# EAGLE design paste_injector (EAGLE 6.5.0)
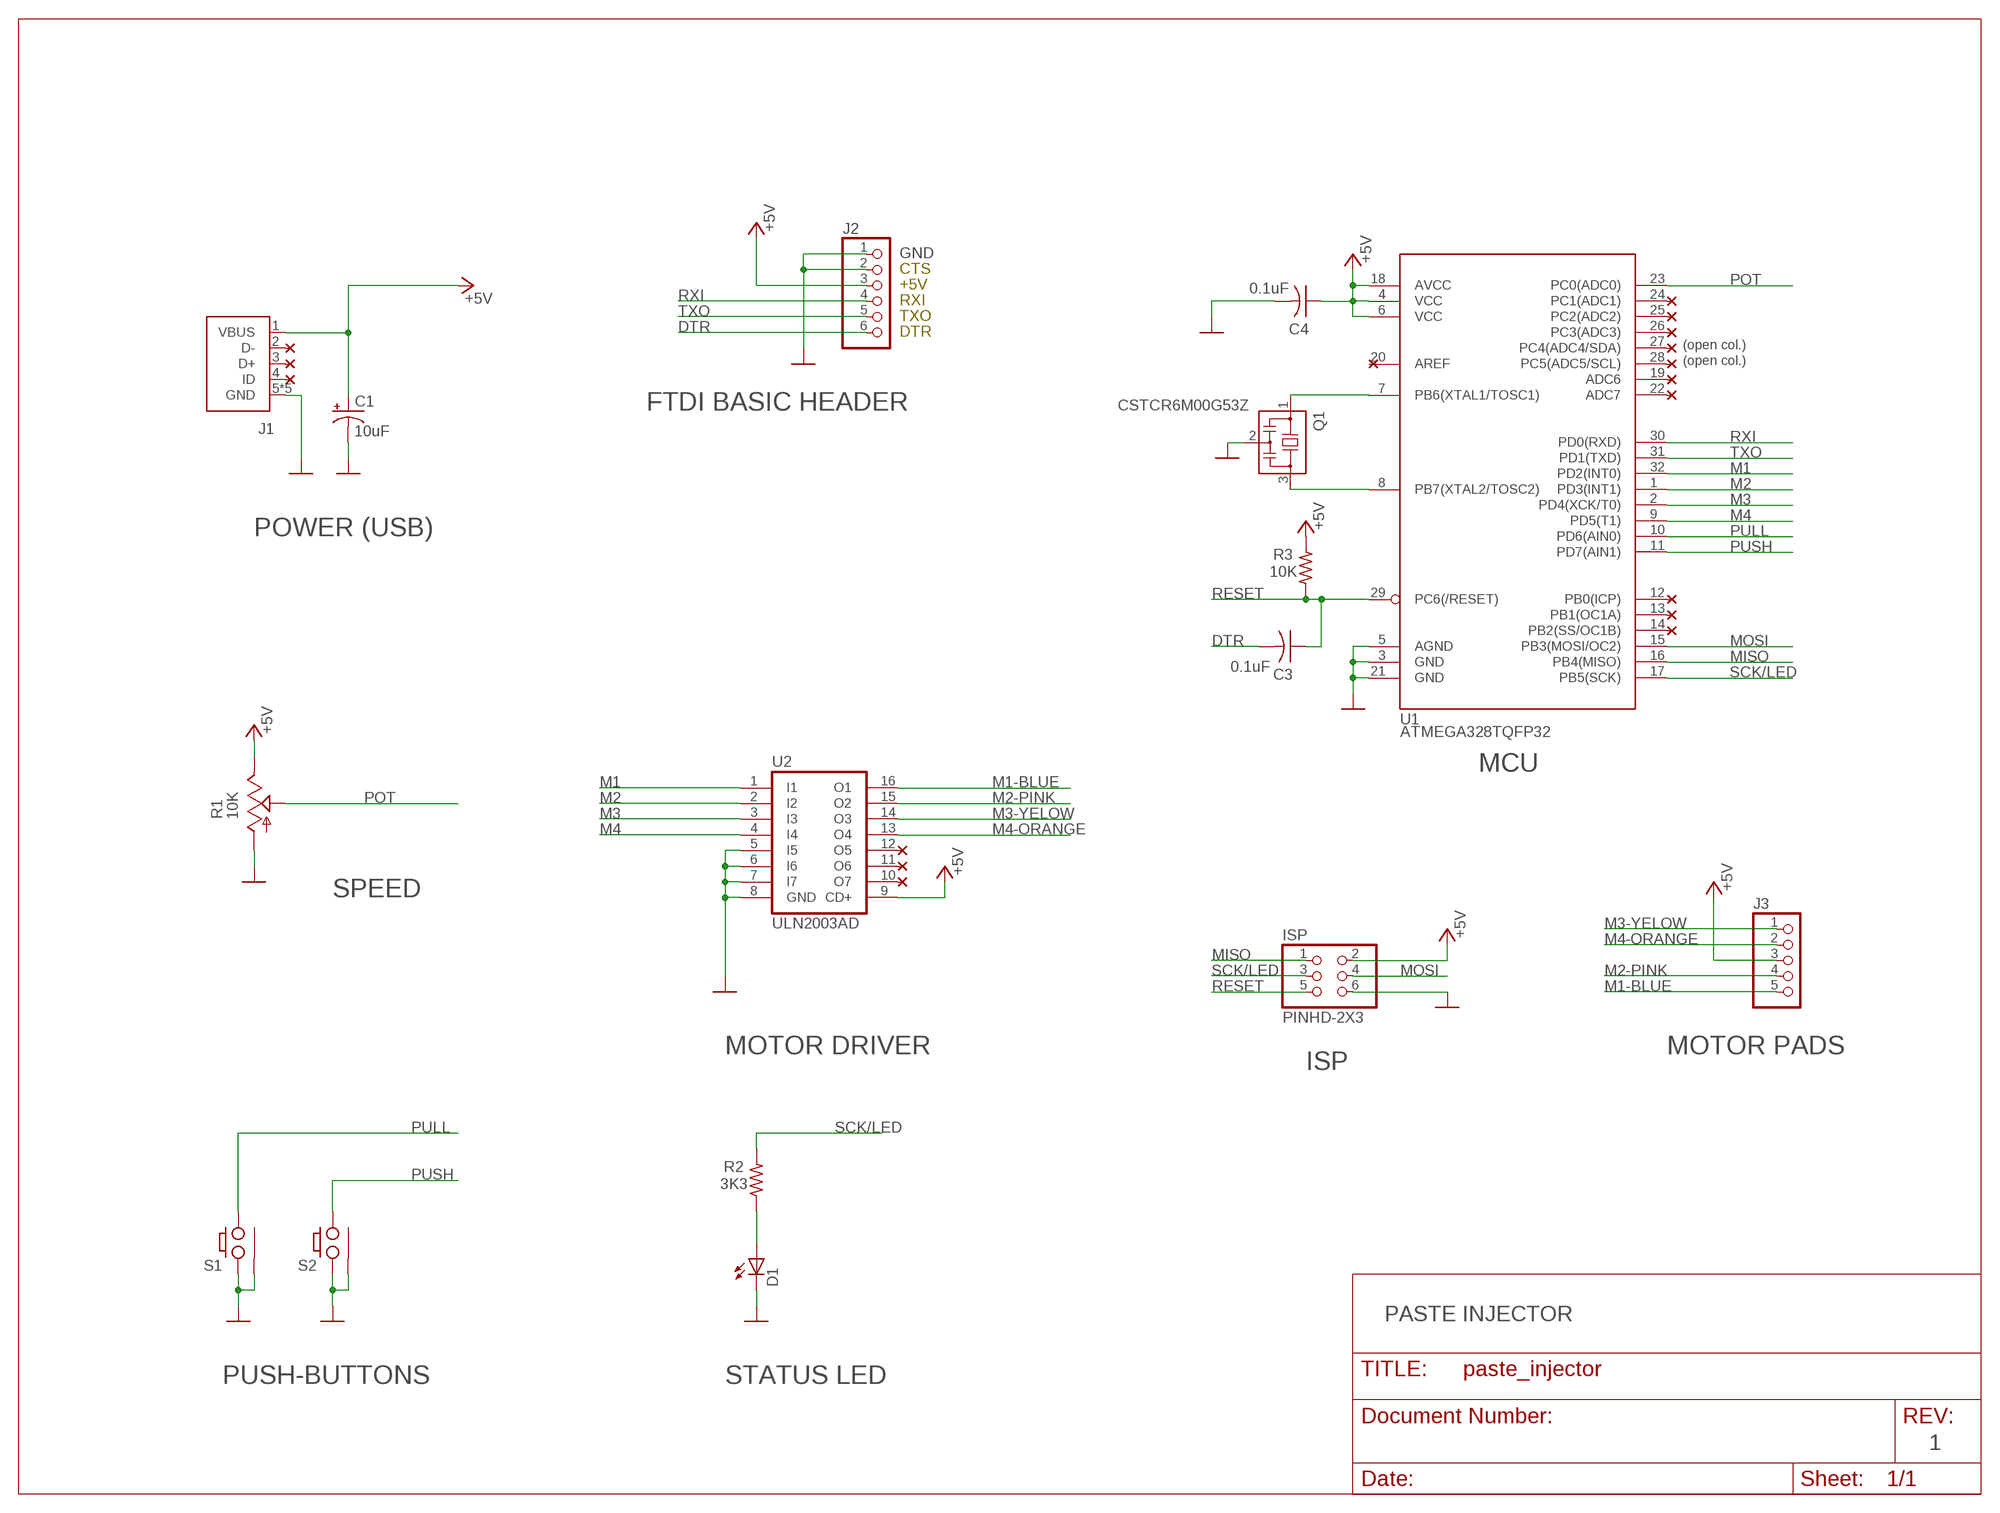
[diagram p0: schematic, sheet 1]

## Parts
C1  10uF  CPOL-USA/3216-18R  [A/3216-18R]
C3  0.1uF  CAP-C0603  [C0603]
C4  0.1uF  CAP-C0603  [C0603]
D1  LED  [LED0603]
ISP  PINHD-2X3  [2X03]
J1  USB  [USB-MICRO-ZX62RD-AB-5P8]
J2  PINHD-1X6  [1X06]
J3  PINHD-1X5  [1X05]
Q1  CSTCR6M00G53Z  [CSTCR6M]
R1  10K  TRIMPOTCA9V  [TRIMPOT]
R2  3K3  RES-R0603  [R0603]
R3  10K  RES-R0603  [R0603]
S1  PUSH_BUTTON  [PUSH_BUTTON]
S2  PUSH_BUTTON  [PUSH_BUTTON]
U1  ATMEGA328TQFP32  [TQFP32-08]
U2  ULN2003AD  [SO16]

## Nets
+5V [power]: C1.+ C4.1 ISP.2 J1.1(VBUS) J2.3 J3.3 R1.CW R3.2 U1.4(VCC) U1.6(VCC) U1.18(AVCC) U2.9(CD+)
DTR: C3.2 J2.6
GND [power]: C1.- C4.2 D1.C ISP.6 J1.5(GND) J1.A(GND) J1.B(GND) J1.C(GND) J1.D(GND) J2.1 J2.2 Q1.2 R1.CCW S1.A1 S1.GND S2.A1 S2.GND U1.3(GND) U1.5(AGND) U1.21(GND) U2.5(I5) U2.6(I6) U2.7(I7) U2.8(GND)
M1: U1.32(PD2(INT0)) U2.1(I1)
M1-BLUE: J3.5 U2.16(O1)
M2: U1.1(PD3(INT1)) U2.2(I2)
M2-PINK: J3.4 U2.15(O2)
M3: U1.2(PD4(XCK/T0)) U2.3(I3)
M3-YELOW: J3.1 U2.14(O3)
M4: U1.9(PD5(T1)) U2.4(I4)
M4-ORANGE: J3.2 U2.13(O4)
MISO: ISP.1 U1.16(PB4(MISO))
MOSI: ISP.4 U1.15(PB3(MOSI/OC2))
N$1: D1.A R2.1
N$2: Q1.1 U1.7(PB6(XTAL1/TOSC1))
N$7: Q1.3 U1.8(PB7(XTAL2/TOSC2))
POT: R1.C U1.23(PC0(ADC0))
PULL: S1.B1 U1.10(PD6(AIN0))
PUSH: S2.B1 U1.11(PD7(AIN1))
RESET: C3.1 ISP.5 R3.1 U1.29(PC6(/RESET))
RXI: J2.4 U1.30(PD0(RXD))
SCK/LED: ISP.3 R2.2 U1.17(PB5(SCK))
TXO: J2.5 U1.31(PD1(TXD))
Unconnected: J1.2(D-) J1.3(D+) J1.4(ID) U1.12(PB0(ICP)) U1.13(PB1(OC1A)) U1.14(PB2(SS/OC1B)) U1.19(ADC6) U1.20(AREF) U1.22(ADC7) U1.24(PC1(ADC1)) U1.25(PC2(ADC2)) U1.26(PC3(ADC3)) U1.27(PC4(ADC4/SDA)) U1.28(PC5(ADC5/SCL)) U2.10(O7) U2.11(O6) U2.12(O5)

## Notes on the sheet
- GND
- CTS
- +5V
- RXI
- TXO
- DTR
- (open col.)
- (open col.)
- FTDI BASIC HEADER
- POWER (USB)
- MCU
- SPEED
- MOTOR DRIVER | MOTOR PADS
- ISP
- PASTE INJECTOR
- PUSH-BUTTONS | STATUS LED
- 1

## Library data of the parts
C1 = paste_injector:CPOL-US
C3 C4 = paste_injector:CAP-: CAPACITOR, American symbol
D1 = paste_injector:LED
ISP = paste_injector:PINHD-2X3
J1 = paste_injector:USB
J2 = paste_injector:PINHD-1X6: PIN HEADER
J3 = paste_injector:PINHD-1X5: PIN HEADER
Q1 = paste_injector:CSTCR: Resonator Source: murata.co.jp; MPN: CSTCR6M00G53-R0; OC_FARNELL: 1170434; OC_NEWARK: 25M8759
R1 = paste_injector:TRIMPOT: POTENTIOMETER
R2 R3 = paste_injector:RES-: RESISTOR, American symbol
S1 S2 = paste_injector:PUSH_BUTTON
U1 = paste_injector:ATMEGA328
U2 = paste_injector:ULN2003A: DRIVER ARRAY

## Net classes
1 power: width 0.305 mm

## Board
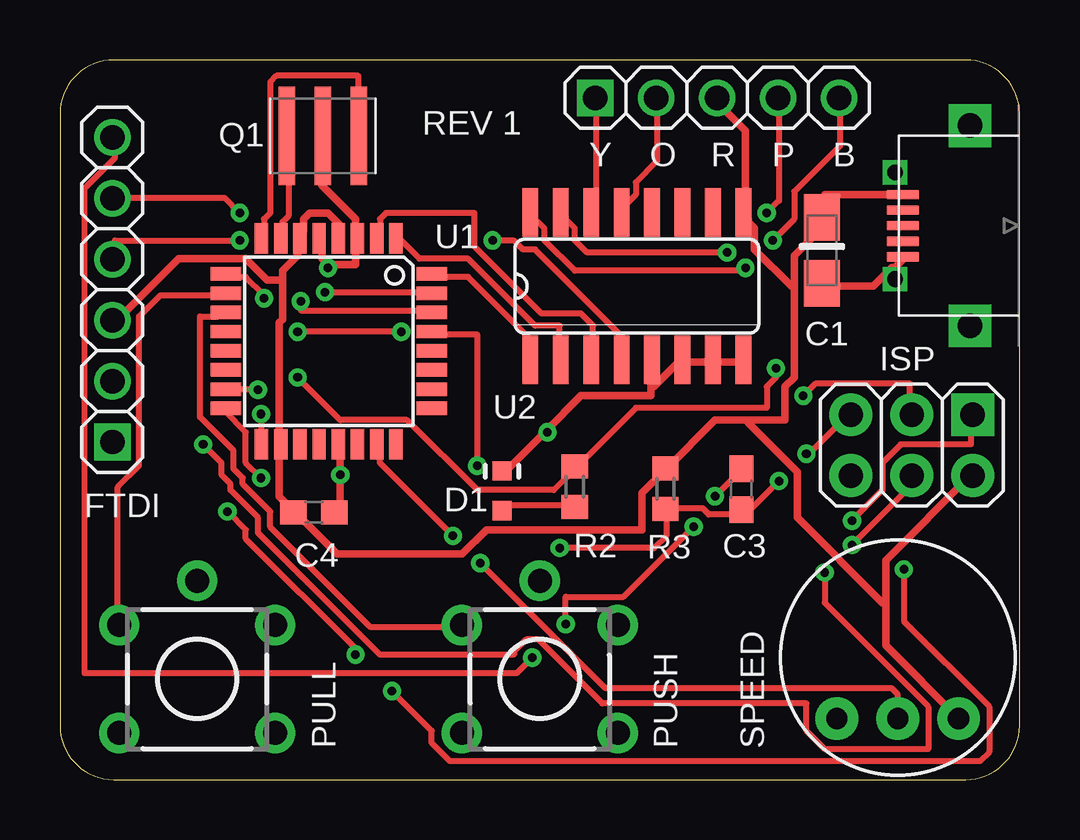
[diagram p1: board, top side]
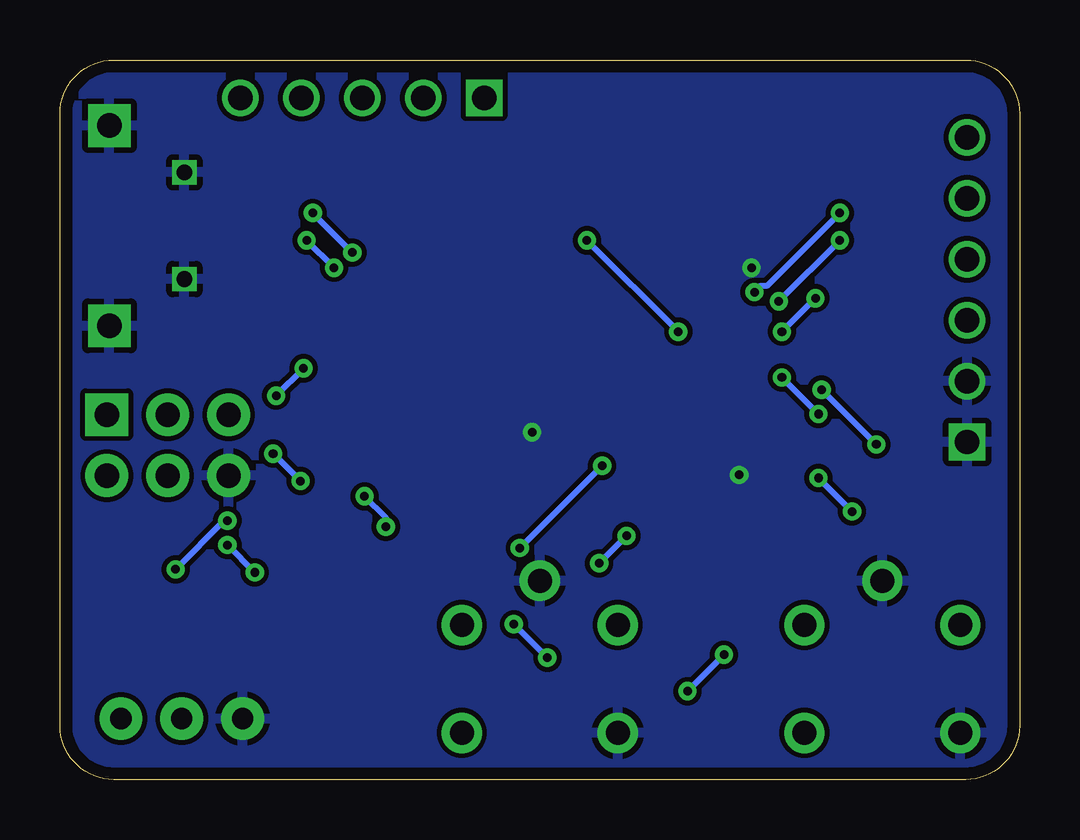
[diagram p2: board, bottom side, seen from below]

Size 40 x 30 mm. Coordinates in mm from the lower left corner, seen from the top.
Outline: 0,27.76 0,2.24 arc90 2.24,0 37.76,0 arc90 40,2.24 40,27.76 arc90 37.76,30 2.24,30 arc90 0,27.76
Copper layers (1*16): Top 0.035mm / dielectric 1.5mm / Bottom 0.035mm
Design rules "default *": minimum track width 10mil, minimum drill 14mil, track to track 8mil, track to pad 8mil, pad to pad 8mil, via to via 8mil, smd to smd 8mil, copper to edge 20mil, drill to drill 8mil, minimum pad ring 7mil, minimum via ring 8mil, stop-mask expansion 4mil, vias tented up to drill 20mil, thermal gap 10mil

### Footprints (pad centres in the part's own frame; a part is rotated, then mirrored left to right if it is on the bottom)
A/3216-18R = smd 1.95 x 1.5: + 1.375,0; - -1.375,0
C0603 = smd 1.1 x 1: 1 -0.85,0; 2 0.85,0
LED0603 = smd 0.8 x 0.8: A 0,-0.825; C 0,0.825
2X03 = drill 1.016 pad 1.778 square: 1 -2.54,-1.27 | drill 1.016 pad 1.778: 2 -2.54,1.27; 3 0,-1.27; 4 0,1.27; 5 2.54,-1.27; 6 2.54,1.27
USB-MICRO-ZX62RD-AB-5P8 = smd 0.4 x 1.35: 1 1.3,5.425; 2 0.65,5.425; 3 0,5.425; 4 -0.65,5.425; 5 -1.3,5.425 | drill 1.016 pad 1.778 square: A -4.175,2.625; D 4.175,2.625 | drill 0.65 pad 0.914 square: B -2.225,5.75; C 2.225,5.75
1X06 = drill 1.016 square: 1 -6.35,0 | drill 1.016: 2 -3.81,0; 3 -1.27,0; 4 1.27,0; 5 3.81,0; 6 6.35,0
1X05 = drill 1.016 square: 1 -5.08,0 | drill 1.016: 2 -2.54,0; 3 0,0; 4 2.54,0; 5 5.08,0
CSTCR6M = smd 0.7 x 4.1: 1 -1.5,0; 2 0,0; 3 1.5,0
TRIMPOT = drill 0.889 pad 1.778: C 0,-2.54; CCW -2.54,-2.54; CW 2.54,-2.54
R0603 = smd 1 x 1.1: 1 -0.85,0; 2 0.85,0
PUSH_BUTTON = drill 1 pad 1.676: A1 -2.25,3.25; A2 -2.25,-3.25; B1 2.25,3.25; B2 2.25,-3.25; GND 4.1,0
TQFP32-08 = smd 1.27 x 0.559: 1 -4.293,2.8; 2 -4.293,2; 3 -4.293,1.2; 4 -4.293,0.4; 5 -4.293,-0.4; 6 -4.293,-1.2; 7 -4.293,-2; 8 -4.293,-2.8; 17 4.293,-2.8; 18 4.293,-2; 19 4.293,-1.2; 20 4.293,-0.4; 21 4.293,0.4; 22 4.293,1.2; 23 4.293,2; 24 4.293,2.8 | smd 0.559 x 1.27: 9 -2.8,-4.293; 10 -2,-4.293; 11 -1.2,-4.293; 12 -0.4,-4.293; 13 0.4,-4.293; 14 1.2,-4.293; 15 2,-4.293; 16 2.8,-4.293; 25 2.8,4.293; 26 2,4.293; 27 1.2,4.293; 28 0.4,4.293; 29 -0.4,4.293; 30 -1.2,4.293; 31 -2,4.293; 32 -2.8,4.293
SO16 = smd 0.66 x 2.032: 1 -4.445,-3.073; 2 -3.175,-3.073; 3 -1.905,-3.073; 4 -0.635,-3.073; 5 0.635,-3.073; 6 1.905,-3.073; 7 3.175,-3.073; 8 4.445,-3.073; 9 4.445,3.073; 10 3.175,3.073; 11 1.905,3.073; 12 0.635,3.073; 13 -0.635,3.073; 14 -1.905,3.073; 15 -3.175,3.073; 16 -4.445,3.073

### Placement (x,y rotation side)
C1  31.76,22.06 90 top
C3  28.41,12.11 90 top
C4  10.59,11.14 0 top
D1  18.42,12.04 0 top
ISP  35.51,13.94 180 top
J1  40.56,23.09 90 top
J2  2.18,20.42 90 top
J3  27.4,28.42 0 top
Q1  10.96,26.84 0 top
R1  34.92,5.08 0 top
R2  21.46,12.21 90 top
R3  25.24,12.12 90 top
S1  5.71,4.19 90 top
S2  20,4.19 90 top
U1  11.2,18.28 270 top
U2  24.05,20.57 0 top

### Tracks (layer width: path | path; a pad name or v marks a point on that pad's centre or on a via)
+5V
  Top 0.305: U1.4 11.68,22.61 11.68,23.11 11.18,23.62 10.41,23.62 10.16,23.37 10.16,22.86 9.91,22.61 U1.6 10.03,22.48 9.91,22.35 9.91,21.84 9.27,21.21 9.27,20.83 | 9.78,11.18 9.14,11.81 9.14,13.97 U1.18 9.14,14.1 9.14,19.05 9.27,19.18 9.27,20.83 | 9.27,20.83 8.64,20.83 7.75,21.72 4.95,21.72 2.29,19.05 J2.3 | R1.CW 34.42,5.59 34.42,7.37 | 34.42,7.37 34.42,9.14 37.97,12.7 ISP.2 | 25.27,12.95 27.3,14.99 28.7,14.99 | 28.7,14.99 30.23,14.99 30.23,16.38 30.61,16.76 30.61,20.57 | 30.61,20.57 30.61,21.84 31.88,23.11 31.88,23.37 C1.+ 31.88,23.5 31.88,24.38 35.05,24.38 J1.1 | 30.61,20.57 30.48,20.57 28.96,22.1 28.96,22.99 28.7,23.24 28.7,23.37 28.45,23.62 U2.9 28.57,23.75 28.57,27.05 27.3,28.32 J3.3 | 34.42,7.37 34.29,7.37 30.73,10.92 30.73,12.83 28.7,14.86 28.7,14.99 | 9.78,11.18 11.56,9.4 16.76,9.4 17.78,10.41 24.26,10.41 24.26,11.94 25.27,12.95 | 9.78,11.18 C4.1 | 25.27,12.95 R3.2
DTR  (via drill 0.36)
  Top 0.254: v27.3,11.81 28.45,12.95 C3.2 | v26.42,10.54 23.5,7.62 21.08,7.62 v21.08,6.48 | v19.68,5.08 19.05,4.45 1.02,4.45 1.02,24.64 2.29,25.91 2.29,26.67 J2.6
  Bottom 0.254: v27.3,11.81 26.42,10.92 v26.42,10.54 | v19.68,5.08 v21.08,6.48
GND  (via drill 0.36)
  Top 0.305: 20.26,14.54 21.72,16 24.64,16 24.64,16.38 | 20.26,14.54 18.54,12.83 D1.C | 24.64,16.38 24.64,17.4 U2.5 | 24.64,16.38 24.77,16.38 25.91,17.53 U2.6 26.04,17.4 27.05,17.4 27.18,17.53 U2.7 27.3,17.4 28.32,17.4 28.45,17.53 U2.8 | 11.18,21.46 10.92,21.72 10.92,22.35 10.79,22.48 U1.5 | 11.18,21.46 12.32,21.46 12.32,22.48 U1.3 12.45,22.61 12.32,22.73 12.32,23.37 10.92,24.77 10.92,26.8 Q1.2 | C4.2 11.43,11.18 11.68,11.43 v11.68,12.7 11.68,13.97 U1.21 | J1.5 35.18,21.72 34.8,21.34 34.8,20.95 J1.B 34.67,21.34 33.91,20.57 31.88,20.57 C1.- | v11.18,21.34 11.18,21.46 | v20.32,14.48 20.26,14.54
  pour Bottom: 0,0 0,29.97 36.83,29.97 40.13,29.97 40.13,1.52 40.13,0
M1
  Top 0.254: U1.32 15.62,21.08 15.75,20.95 17.02,20.95 19.68,18.29 19.68,17.53 U2.1
M1-BLUE  (via drill 0.36)
  Top 0.254: v28.57,21.34 28.57,21.21 21.46,21.21 20.19,22.48 20.19,22.99 19.56,23.62 U2.16 | v29.72,22.48 30.61,23.37 30.61,24.51 32.51,26.42 32.51,28.32 J3.5
  Bottom 0.254: v29.72,22.48 v28.57,21.34
M2
  Top 0.254: U1.1 14.1,22.61 14.99,21.72 17.02,21.72 19.81,18.92 20.83,18.92 20.83,17.53 U2.2
M2-PINK  (via drill 0.36)
  Top 0.254: v27.81,21.97 21.97,21.97 21.46,22.48 21.46,22.99 20.83,23.62 U2.15 | v29.46,23.62 29.97,24.13 29.97,28.32 J3.4
  Bottom 0.254: v29.46,23.62 v27.81,21.97
M3
  Top 0.254: U1.2 13.08,22.61 13.34,22.86 13.34,23.37 13.59,23.62 17.27,23.62 17.27,22.23 20.07,19.43 21.72,19.43 22.23,18.92 22.23,17.53 U2.3
M3-YELOW
  Top 0.254: U2.14 22.1,23.75 22.35,24 22.35,28.32 J3.1
M4  (via drill 0.36)
  Top 0.254: v8.51,20.07 8.51,20.19 7.75,20.95 7.11,20.95 6.99,21.08 U1.9 | v14.22,18.67 v9.91,18.67 | v18.03,22.48 18.92,22.48 19.3,22.1 19.81,22.1 23.5,18.41 23.5,17.53 U2.4
  Bottom 0.254: v9.91,18.67 v8.51,20.07 | v18.03,22.48 v14.22,18.67
M4-ORANGE
  Top 0.254: U2.13 23.37,23.75 24,24.38 24,24.89 24.89,25.78 24.89,28.32 J3.2
MISO  (via drill 0.36)
  Top 0.254: v8.38,12.57 7.75,13.21 7.75,14.48 6.86,15.37 U1.16 | v6.99,11.18 7.75,10.41 7.75,10.03 12.32,5.46 v12.32,5.21 | v13.84,3.68 15.49,2.03 15.49,1.52 16.26,0.76 38.35,0.76 38.73,1.14 38.73,3.05 35.18,6.6 v35.18,8.76 | v33.02,10.79 34.29,12.06 34.29,13.21 35.05,13.97 37.97,13.97 37.97,15.11 ISP.1
  Bottom 0.254: v6.99,11.18 v8.38,12.57 | v13.84,3.68 v12.32,5.21 | v35.18,8.76 33.15,10.79 v33.02,10.79
MOSI  (via drill 0.36)
  Top 0.254: v8.26,16.26 7.11,16.26 6.99,16.38 U1.15 | v5.97,13.97 6.73,13.21 6.73,12.7 7.11,12.32 7.11,12.06 8.26,10.92 8.26,10.29 13.34,5.21 18.92,5.21 18.92,5.33 19.43,5.84 19.94,5.84 22.61,3.17 31.11,3.17 31.11,2.03 31.88,1.27 36.2,1.27 36.2,3.05 31.88,7.37 v31.88,8.64 | v33.02,9.78 35.56,12.32 35.56,12.57 ISP.4
  Bottom 0.254: v5.97,13.97 v8.26,16.26 | v33.02,9.78 v31.88,8.64
N$1
  Top 0.254: D1.A 18.54,11.18 18.8,11.43 21.34,11.43 R2.1
N$2
  Top 0.254: U1.7 9.14,22.61 9.27,22.73 9.27,23.24 9.53,23.5 9.53,26.8 Q1.1
N$7
  Top 0.254: U1.8 8.38,22.61 8.51,22.73 8.51,23.37 8.76,23.62 8.76,29.08 9.02,29.34 12.45,29.34 12.45,26.92 Q1.3
POT  (via drill 0.36)
  Top 0.254: v16.38,10.16 13.34,13.21 13.34,13.72 13.08,13.97 U1.23 | v17.53,9.02 22.73,3.81 34.67,3.81 34.92,3.56 R1.C
  Bottom 0.254: v17.53,9.02 v16.38,10.16
PULL
  Top 0.254: U1.10 6.86,20.32 6.73,20.19 4.19,20.19 3.3,19.3 3.3,13.08 2.41,12.19 2.41,6.48 S1.B1
PUSH
  Top 0.254: U1.11 6.86,19.56 6.6,19.3 5.84,19.3 5.84,15.11 7.24,13.72 7.24,12.95 7.62,12.57 7.62,12.32 8.76,11.18 8.76,10.54 12.95,6.35 16.64,6.35 S2.B1
RESET  (via drill 0.36)
  Top 0.254: v17.4,13.08 17.4,18.54 15.88,18.54 15.62,18.8 U1.29 | v20.83,9.65 24.77,9.65 25.27,10.16 25.27,11.05 R3.1 25.27,11.18 25.4,11.3 26.8,11.3 27.05,11.05 28.32,11.05 28.32,11.18 C3.1 28.45,11.18 28.7,11.18 v29.97,12.45 | v31.11,13.59 31.24,13.59 32.89,15.24 ISP.5
  Bottom 0.254: v20.83,9.65 v17.4,13.08 | v29.97,12.45 v31.11,13.59
RXI  (via drill 0.36)
  Top 0.254: v10.03,19.94 10.03,19.56 15.37,19.56 15.49,19.43 U1.30 | v7.49,22.48 2.29,22.48 2.29,21.72 J2.4
  Bottom 0.254: v7.49,22.48 v10.03,19.94
SCK/LED  (via drill 0.36)
  Top 0.254: 21.46,12.95 24,15.49 29.46,15.49 29.46,16.38 29.84,16.76 v29.84,17.14 | v30.99,16 31.5,16.51 35.43,16.51 35.43,15.24 ISP.3 | v8.38,15.24 8.38,14.22 8.51,14.1 U1.17 | v9.91,16.76 11.68,14.99 14.48,14.99 17.4,12.06 20.57,12.06 21.46,12.95 | 21.46,12.95 R2.2
  Bottom 0.254: v30.99,16 v29.84,17.14 | v9.91,16.76 v8.38,15.24
TXO  (via drill 0.36)
  Top 0.254: v11.05,20.32 15.37,20.32 15.49,20.19 U1.31 | v7.49,23.62 6.86,24.26 2.29,24.26 J2.5
  Bottom 0.254: v11.05,20.32 10.79,20.57 10.54,20.57 v7.49,23.62

### Text on the board
tPlace: REV 1 | Y | O | R | P | B | FTDI | PULL | PUSH | SPEED